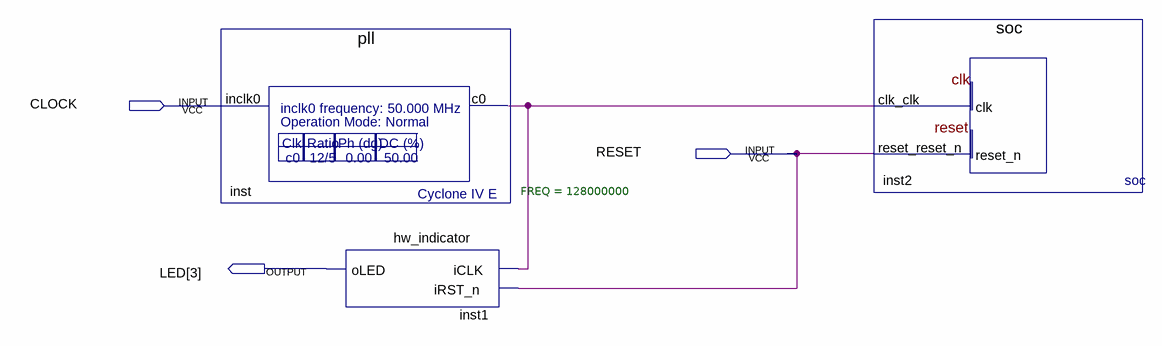
[diagram p0: schematic sheet]
// Quartus schematic top.bdf as structural Verilog: 3 symbols, 3 pins
module top (
  input  CLOCK,
  input  RESET,
  output [3:3] LED
);

  wire inst_c0;

  pll inst (.c0(inst_c0));  // open: inclk0
  hw_indicator #(.FREQ(128000000)) inst1 (.iCLK(inst_c0), .iRST_n(RESET), .oLED(LED[3]));
  soc inst2 (.clk_clk(inst_c0), .reset_reset_n(RESET));
endmodule
